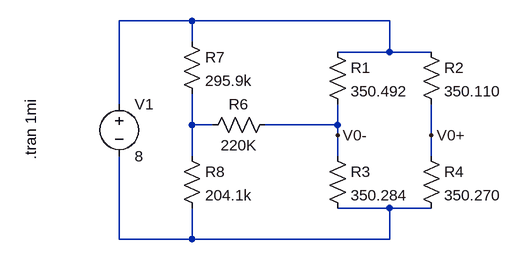
[diagram p0: schematic Wheatsone-Bridge-200g-reset.asc]
Wheatsone-Bridge-200g-reset.asc, the LTspice schematic file:
Version 4.1
SHEET 1 880 680
WIRE 48 -16 -64 -16
WIRE 352 -16 48 -16
WIRE 48 16 48 -16
WIRE 352 32 352 -16
WIRE 352 32 272 32
WIRE 416 32 352 32
WIRE -64 112 -64 -16
WIRE 48 144 48 96
WIRE 80 144 48 144
WIRE 272 144 272 112
WIRE 272 144 160 144
WIRE 272 160 272 144
WIRE 416 160 416 112
WIRE 48 192 48 144
WIRE 272 192 272 160
WIRE 416 192 416 160
WIRE 352 272 272 272
WIRE 416 272 352 272
WIRE -64 320 -64 192
WIRE 48 320 48 272
WIRE 48 320 -64 320
WIRE 352 320 352 272
WIRE 352 320 48 320
FLAG 272 160 V0-
FLAG 416 160 V0+
SYMBOL voltage -64 96 R0
WINDOW 123 0 0 Left 0
WINDOW 39 0 0 Left 0
SYMATTR InstName V1
SYMATTR Value 8
SYMBOL res 256 16 R0
SYMATTR InstName R1
SYMATTR Value 350.492
SYMBOL res 400 16 R0
SYMATTR InstName R2
SYMATTR Value 350.110
SYMBOL res 256 176 R0
SYMATTR InstName R3
SYMATTR Value 350.284
SYMBOL res 400 176 R0
SYMATTR InstName R4
SYMATTR Value 350.270
SYMBOL res 176 128 R90
WINDOW 0 0 56 VBottom 2
WINDOW 3 32 56 VTop 2
SYMATTR InstName R6
SYMATTR Value 220K
SYMATTR SpiceLine tol=5 pwr=0.250
SYMBOL res 32 0 R0
SYMATTR InstName R7
SYMATTR Value 295.9k
SYMBOL res 32 176 R0
SYMATTR InstName R8
SYMATTR Value 204.1k
TEXT -200 104 VRight 2 !.tran 1mi

The netlist it stands for:
* Wheatsone-Bridge-200g-reset.asc
V1 N001 N003 8
R1 N001 V0- 350.492
R2 N001 V0+ 350.110
R3 V0- N003 350.284
R4 V0+ N003 350.270
R6 V0- N002 220K tol=5 pwr=0.250
R7 N001 N002 295.9k
R8 N002 N003 204.1k
.tran 1mi
.backanno
.end